# EAGLE design hexapodtroller_power (EAGLE 5.11)
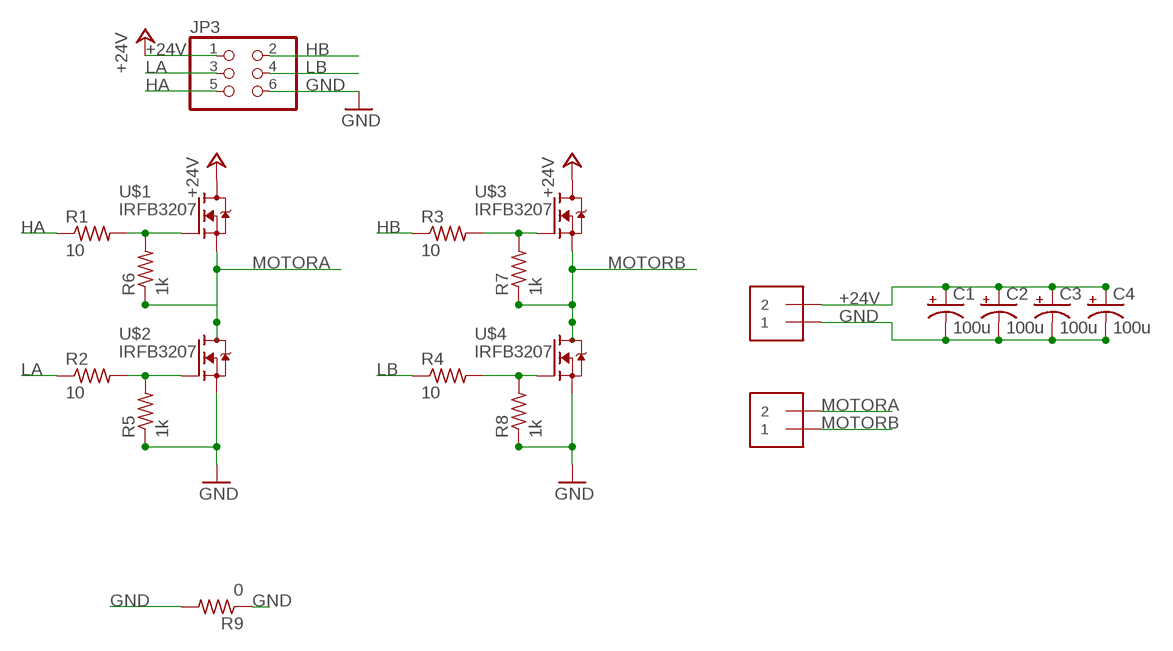
[diagram p0: schematic, sheet 1]

## Parts
C1  100u  CPOL-USE5-10.5  [E5-10,5]
C2  100u  CPOL-USE5-10.5  [E5-10,5]
C3  100u  CPOL-USE5-10.5  [E5-10,5]
C4  100u  CPOL-USE5-10.5  [E5-10,5]
J1  1X2-3.5MM  [1X2-3.5MM]
J2  1X2-3.5MM  [1X2-3.5MM]
JP3  PINHD-2X3-SMD  [2X03SMD]
R1  10  RES-US1206FAB  [R1206FAB]
R2  10  RES-US1206FAB  [R1206FAB]
R3  10  RES-US1206FAB  [R1206FAB]
R4  10  RES-US1206FAB  [R1206FAB]
R5  1k  RES-US1206FAB  [R1206FAB]
R6  1k  RES-US1206FAB  [R1206FAB]
R7  1k  RES-US1206FAB  [R1206FAB]
R8  1k  RES-US1206FAB  [R1206FAB]
R9  0  RES-US1206FAB  [R1206FAB]
U$1  IRFB3207  [TO220AB]
U$2  IRFB3207  [TO220AB]
U$3  IRFB3207  [TO220AB]
U$4  IRFB3207  [TO220AB]

## Nets
+24V: C1.+ C2.+ C3.+ C4.+ J1.2 JP3.1 U$1.D U$3.D
GND: C1.- C2.- C3.- C4.- J1.1 JP3.6 R5.1 R8.1 R9.1 R9.2 U$2.S U$4.S
HA: JP3.5 R1.1
HB: JP3.2 R3.1
LA: JP3.3 R2.1
LB: JP3.4 R4.1
MOTORA: J2.2 R6.1 U$1.S U$2.D
MOTORB: J2.1 R7.1 U$3.S U$4.D
N$1: R1.2 R6.2 U$1.G
N$2: R2.2 R5.2 U$2.G
N$3: R3.2 R7.2 U$3.G
N$4: R4.2 R8.2 U$4.G

## Library data of the parts
C1-C4 = rcl:CPOL-US: POLARIZED CAPACITOR, American symbol
J1 J2 = adafruit:1X2: 3.5mm Terminal block http://www.ladyada.net/library/pcb/eaglelibrary.html
JP3 = fab:PINHD-2X3-SMD: PIN HEADER
R1-R9 = fab:RES-US: Resistor (US Symbol) Variants with postfix FAB are widened to allow the routing of internal traces
U$1-U$4 = emergencylibrary:IRFB3207: NFET 75V 120A 2.1mOhm IRFB3207 T0-220AB

## Board
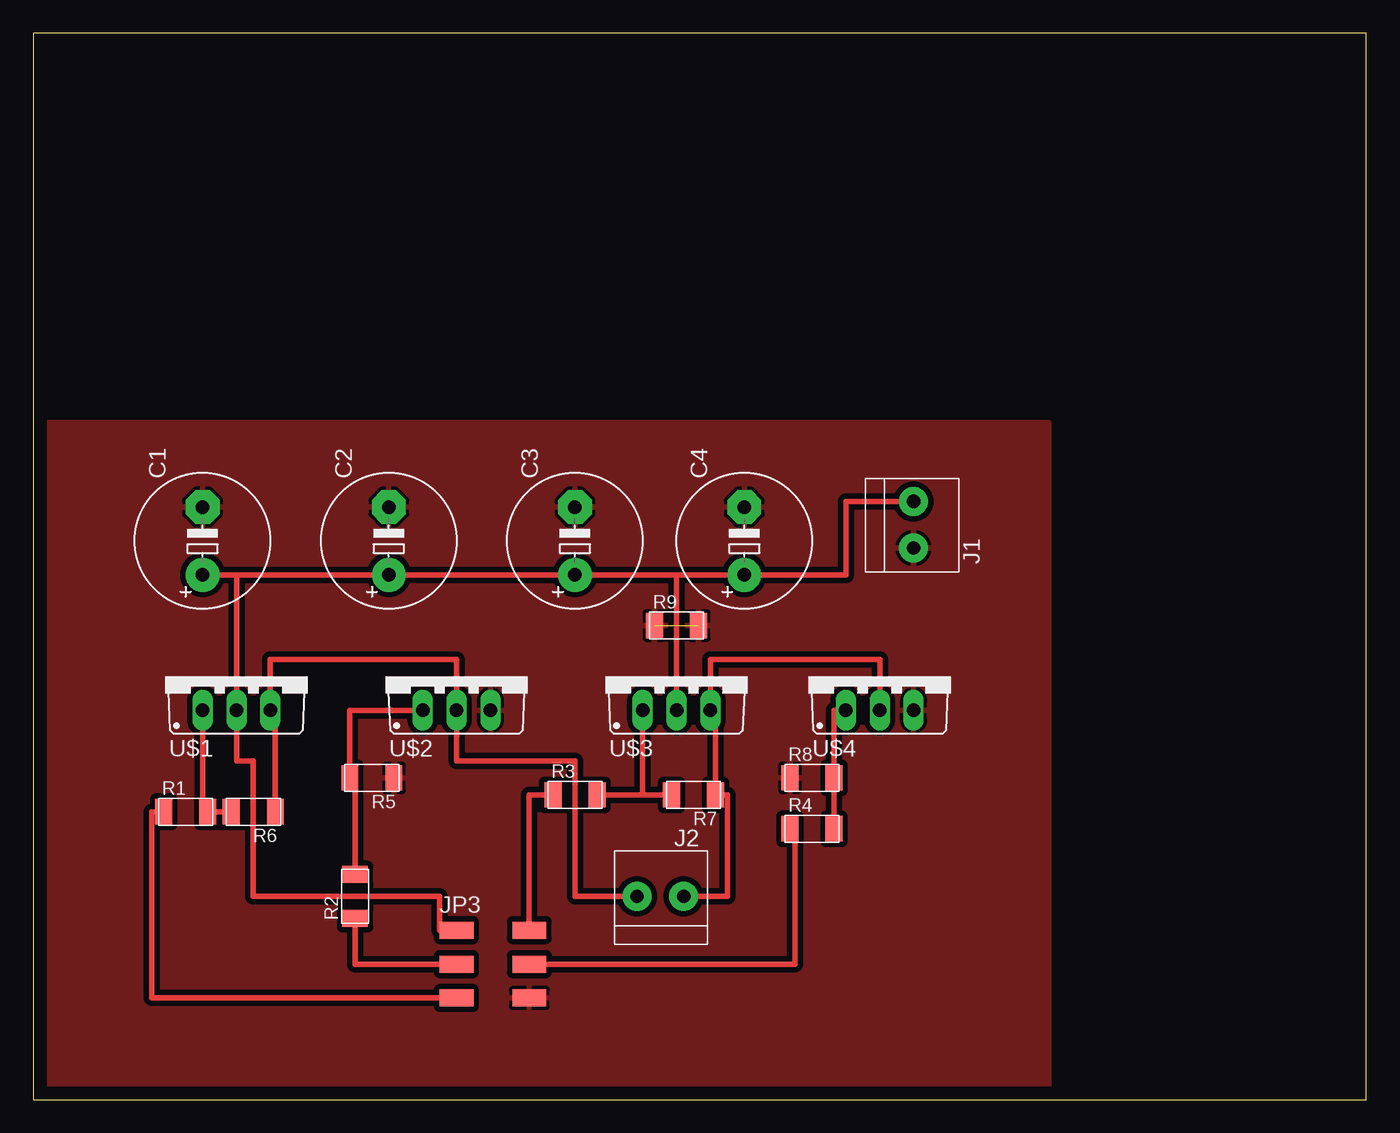
[diagram p1: board, top side]

Size 100 x 80 mm. Coordinates in mm from the lower left corner, seen from the top.
Outline: 0,0 100,0 100,80 0,80 0,0
Copper layers (1*16): Top 0.035mm / dielectric 1.5mm / Bottom 0.035mm
Design rules "default": minimum track width 10mil, minimum drill 24mil, track to track 8mil, track to pad 8mil, pad to pad 8mil, via to via 8mil, smd to smd 8mil, copper to edge 40mil, drill to drill 8mil, minimum pad ring 10mil, minimum via ring 8mil, stop-mask expansion 4mil, vias tented up to drill 0mil, thermal gap 10mil

### Footprints (pad centres in the part's own frame; a part is rotated, then mirrored left to right if it is on the bottom)
E5-10,5 = drill 1.016 pad 2.54 round: + -2.54,0 | drill 1.016 pad 2.54 octagon: - 2.54,0
1X2-3.5MM = drill 1 pad 2.184 round: 1 1.8,0; 2 -1.7,0
2X03SMD = smd 2.54 x 1.27: 1 -2.54,2.54; 2 2.92,2.54; 3 -2.54,0; 4 2.92,0; 5 -2.54,-2.54; 6 2.92,-2.54
R1206FAB = smd 1.27 x 1.905: 1 -1.651,0; 2 1.651,0
TO220AB = drill 1.016 long: D -3.81,1.27; G -6.35,1.27; S -1.27,1.27

### Placement (x,y rotation side)
C1  12.7,41.91 90 top
C2  26.67,41.91 90 top
C3  40.64,41.91 90 top
C4  53.34,41.91 90 top
J1  66.04,43.18 270 top
J2  46.99,15.24 0 top
JP3  34.29,10.16 0 top
R1  11.43,21.59 0 top
R2  24.13,15.24 90 top
R3  40.64,22.86 0 top
R4  58.42,20.32 0 top
R5  25.4,24.13 180 top
R6  16.51,21.59 180 top
R7  49.53,22.86 180 top
R8  58.42,24.13 0 top
R9  48.26,35.56 0 top
U$1  19.05,27.94 0 top
U$2  35.56,27.94 0 top
U$3  52.07,27.94 0 top
U$4  67.31,27.94 0 top

### Tracks (layer width: path | path; a pad name or v marks a point on that pad's centre or on a via)
+24V
  Top 0.406: J1.2 60.96,44.88 60.96,39.37 C4.+ | C4.+ C3.+ C2.+ C1.+ 15.24,39.37 U$1.D 15.24,25.4 16.51,25.4 16.51,15.24 30.48,15.24 30.48,12.7 JP3.1 | C4.+ 48.26,39.37 U$3.D
GND  (1 unrouted)
  pour Top (isolate 0.406): 0,0 76.2,0 76.2,50.8 0,50.8
HA
  Top 0.406: R1.1 8.89,21.59 8.89,7.62 JP3.5
HB
  Top 0.406: R3.1 37.21,22.86 JP3.2
LA
  Top 0.406: R2.1 24.13,10.16 JP3.3
LB
  Top 0.406: R4.1 57.15,20.32 57.15,10.16 JP3.4
MOTORA
  Top 0.406: R6.1 18.16,29.21 U$1.S 17.78,33.02 31.75,33.02 U$2.D 31.75,25.4 40.64,25.4 40.64,15.24 J2.2
MOTORB
  Top 0.406: U$4.D 63.5,33.02 50.8,33.02 U$3.S 51.18,29.21 R7.1 52.07,22.86 52.07,15.24 J2.1
N$1
  Top 0.406: R6.2 R1.2 12.7,21.59 U$1.G
N$2
  Top 0.406: U$2.G 23.75,29.21 R5.2 24.13,24.13 R2.2
N$3
  Top 0.406: 45.72,22.86 U$3.G | 45.72,22.86 R7.2 | R3.2 45.72,22.86
N$4
  Top 0.406: U$4.G 60.07,29.21 R8.2 R4.2